# Altium schematic sheet 08-NANDStatusLed.SchDoc
size A4; DocumentNumber: 8; SheetNumber: 8; SheetTotal: 26
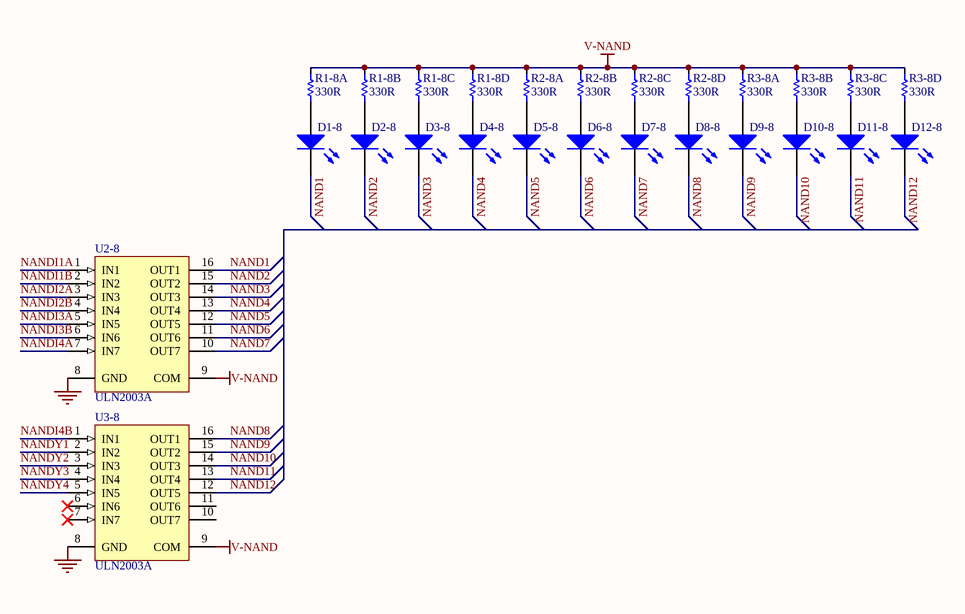
[diagram p0: 08-NANDStatusLed.SchDoc]

## Parts
D1-8  LED  [LED-0805]  (value not drawn)
D2-8  LED  [LED-0805]  (value not drawn)
D3-8  LED  [LED-0805]  (value not drawn)
D4-8  LED  [LED-0805]  (value not drawn)
D5-8  LED  [LED-0805]  (value not drawn)
D6-8  LED  [LED-0805]  (value not drawn)
D7-8  LED  [LED-0805]  (value not drawn)
D8-8  LED  [LED-0805]  (value not drawn)
D9-8  LED  [LED-0805]  (value not drawn)
D10-8  LED  [LED-0805]  (value not drawn)
D11-8  LED  [LED-0805]  (value not drawn)
D12-8  LED  [LED-0805]  (value not drawn)
R1-8  330R  [R-Array-0603-4]  (parts A,B,C,D of 4)
R2-8  330R  [R-Array-0603-4]  (parts A,B,C,D of 4)
R3-8  330R  [R-Array-0603-4]  (parts A,B,C,D of 4)
U2-8  ULN2003A  [SOIC-16]
U3-8  ULN2003A  [SOIC-16]

## Nets
GND: U2-8.8(GND) U3-8.8(GND)
V-NAND: R1-8.2 R1-8.4 R1-8.6 R1-8.8 R2-8.2 R2-8.4 R2-8.6 R2-8.8 R3-8.2 R3-8.4 R3-8.6 R3-8.8 U2-8.9(COM) U3-8.9(COM)
NAND1: D1-8.2(K) U2-8.16(OUT1)
NAND2: D2-8.2(K) U2-8.15(OUT2)
NAND3: D3-8.2(K) U2-8.14(OUT3)
NAND4: D4-8.2(K) U2-8.13(OUT4)
NAND5: D5-8.2(K) U2-8.12(OUT5)
NAND6: D6-8.2(K) U2-8.11(OUT6)
NAND7: D7-8.2(K) U2-8.10(OUT7)
NAND8: D8-8.2(K) U3-8.16(OUT1)
NAND9: D9-8.2(K) U3-8.15(OUT2)
NAND10: D10-8.2(K) U3-8.14(OUT3)
NAND11: D11-8.2(K) U3-8.13(OUT4)
NAND12: D12-8.2(K) U3-8.12(OUT5)
NANDI1A: U2-8.1(IN1)
NANDI1B: U2-8.2(IN2)
NANDI2A: U2-8.3(IN3)
NANDI2B: U2-8.4(IN4)
NANDI3A: U2-8.5(IN5)
NANDI3B: U2-8.6(IN6)
NANDI4A: U2-8.7(IN7)
NANDI4B: U3-8.1(IN1)
NANDY1: U3-8.2(IN2)
NANDY2: U3-8.3(IN3)
NANDY3: U3-8.4(IN4)
NANDY4: U3-8.5(IN5)
NetD1-8_1: D1-8.1(A) R1-8.1
NetD2-8_1: D2-8.1(A) R1-8.3
NetD3-8_1: D3-8.1(A) R1-8.5
NetD4-8_1: D4-8.1(A) R1-8.7
NetD5-8_1: D5-8.1(A) R2-8.1
NetD6-8_1: D6-8.1(A) R2-8.3
NetD7-8_1: D7-8.1(A) R2-8.5
NetD8-8_1: D8-8.1(A) R2-8.7
NetD9-8_1: D9-8.1(A) R3-8.1
NetD10-8_1: D10-8.1(A) R3-8.3
NetD11-8_1: D11-8.1(A) R3-8.5
NetD12-8_1: D12-8.1(A) R3-8.7

Not connected (* = marked no-connect by the designer): U3-8 6(IN6)* 7(IN7)* 10(OUT7) 11(OUT6)

## Library data of the parts
D1-8 D2-8 D3-8 D4-8 D5-8 D6-8 D7-8 D8-8 D9-8 D10-8 D11-8 D12-8 = LED2: Typical RED, GREEN, YELLOW, AMBER GaAs LED; Published: 8-Jun-2000; LatestRevisionDate: 17-Jul-2002; LatestRevisionNote: Re-released for DXP Platform.; PackageVersion: Feb-2002; PackageReference: 3.2X1.6X1.1; Publisher: Altium Limited; PackageDescription: SM LED; 2 Flat Leads
R1-8 R2-8 R3-8 = Res Array 4: RES ARRAY 4 RES 330 OHM 1206; Manufacturer: Panasonic Electronic Components; Manufacturer Part Number: EXB-38V331JV; Digi-Key Part Number: Y9331TR-ND; Link: http://www.digikey.com/product-detail/en/EXB-38V331JV/Y9331TR-ND/256525
U2-8 U3-8 = ULN2003A: High-Voltage, High-Current Darlington Array; Published: 13-Oct-2000; LatestRevisionDate: 06-Jun-2005; LatestRevisionNote: Stylized 3D Model Added.; DatasheetVersion: 1998; PackageVersion: 1998; PackageReference: A16; Publisher: Altium Limited; PackageDescription: DIP; 16 Leads; Row Spacing 7.62 mm; Pitch 2.54 mm; Code_JEDEC: MS-001-BB; ComponentLink1Description: Manufacturer Link; ComponentLink1URL: http://www.allegromicro.com/